# Altium schematic sheet ST_LINK_V2-1_2.SCHDOC: ST-LINK/V2-1
size A3; Author: P.A.; CompanyName: STMicroelectronics; Organization: Microcontrollers Division; Address1: 12, Rue Jules HOROWITZ; Address2: 38019 Grenoble; Address3: FRANCE; DocumentNumber: MB1261; Revision: B.01; SheetNumber: 5; SheetTotal: 15; Project: STM32L496G-DISCO
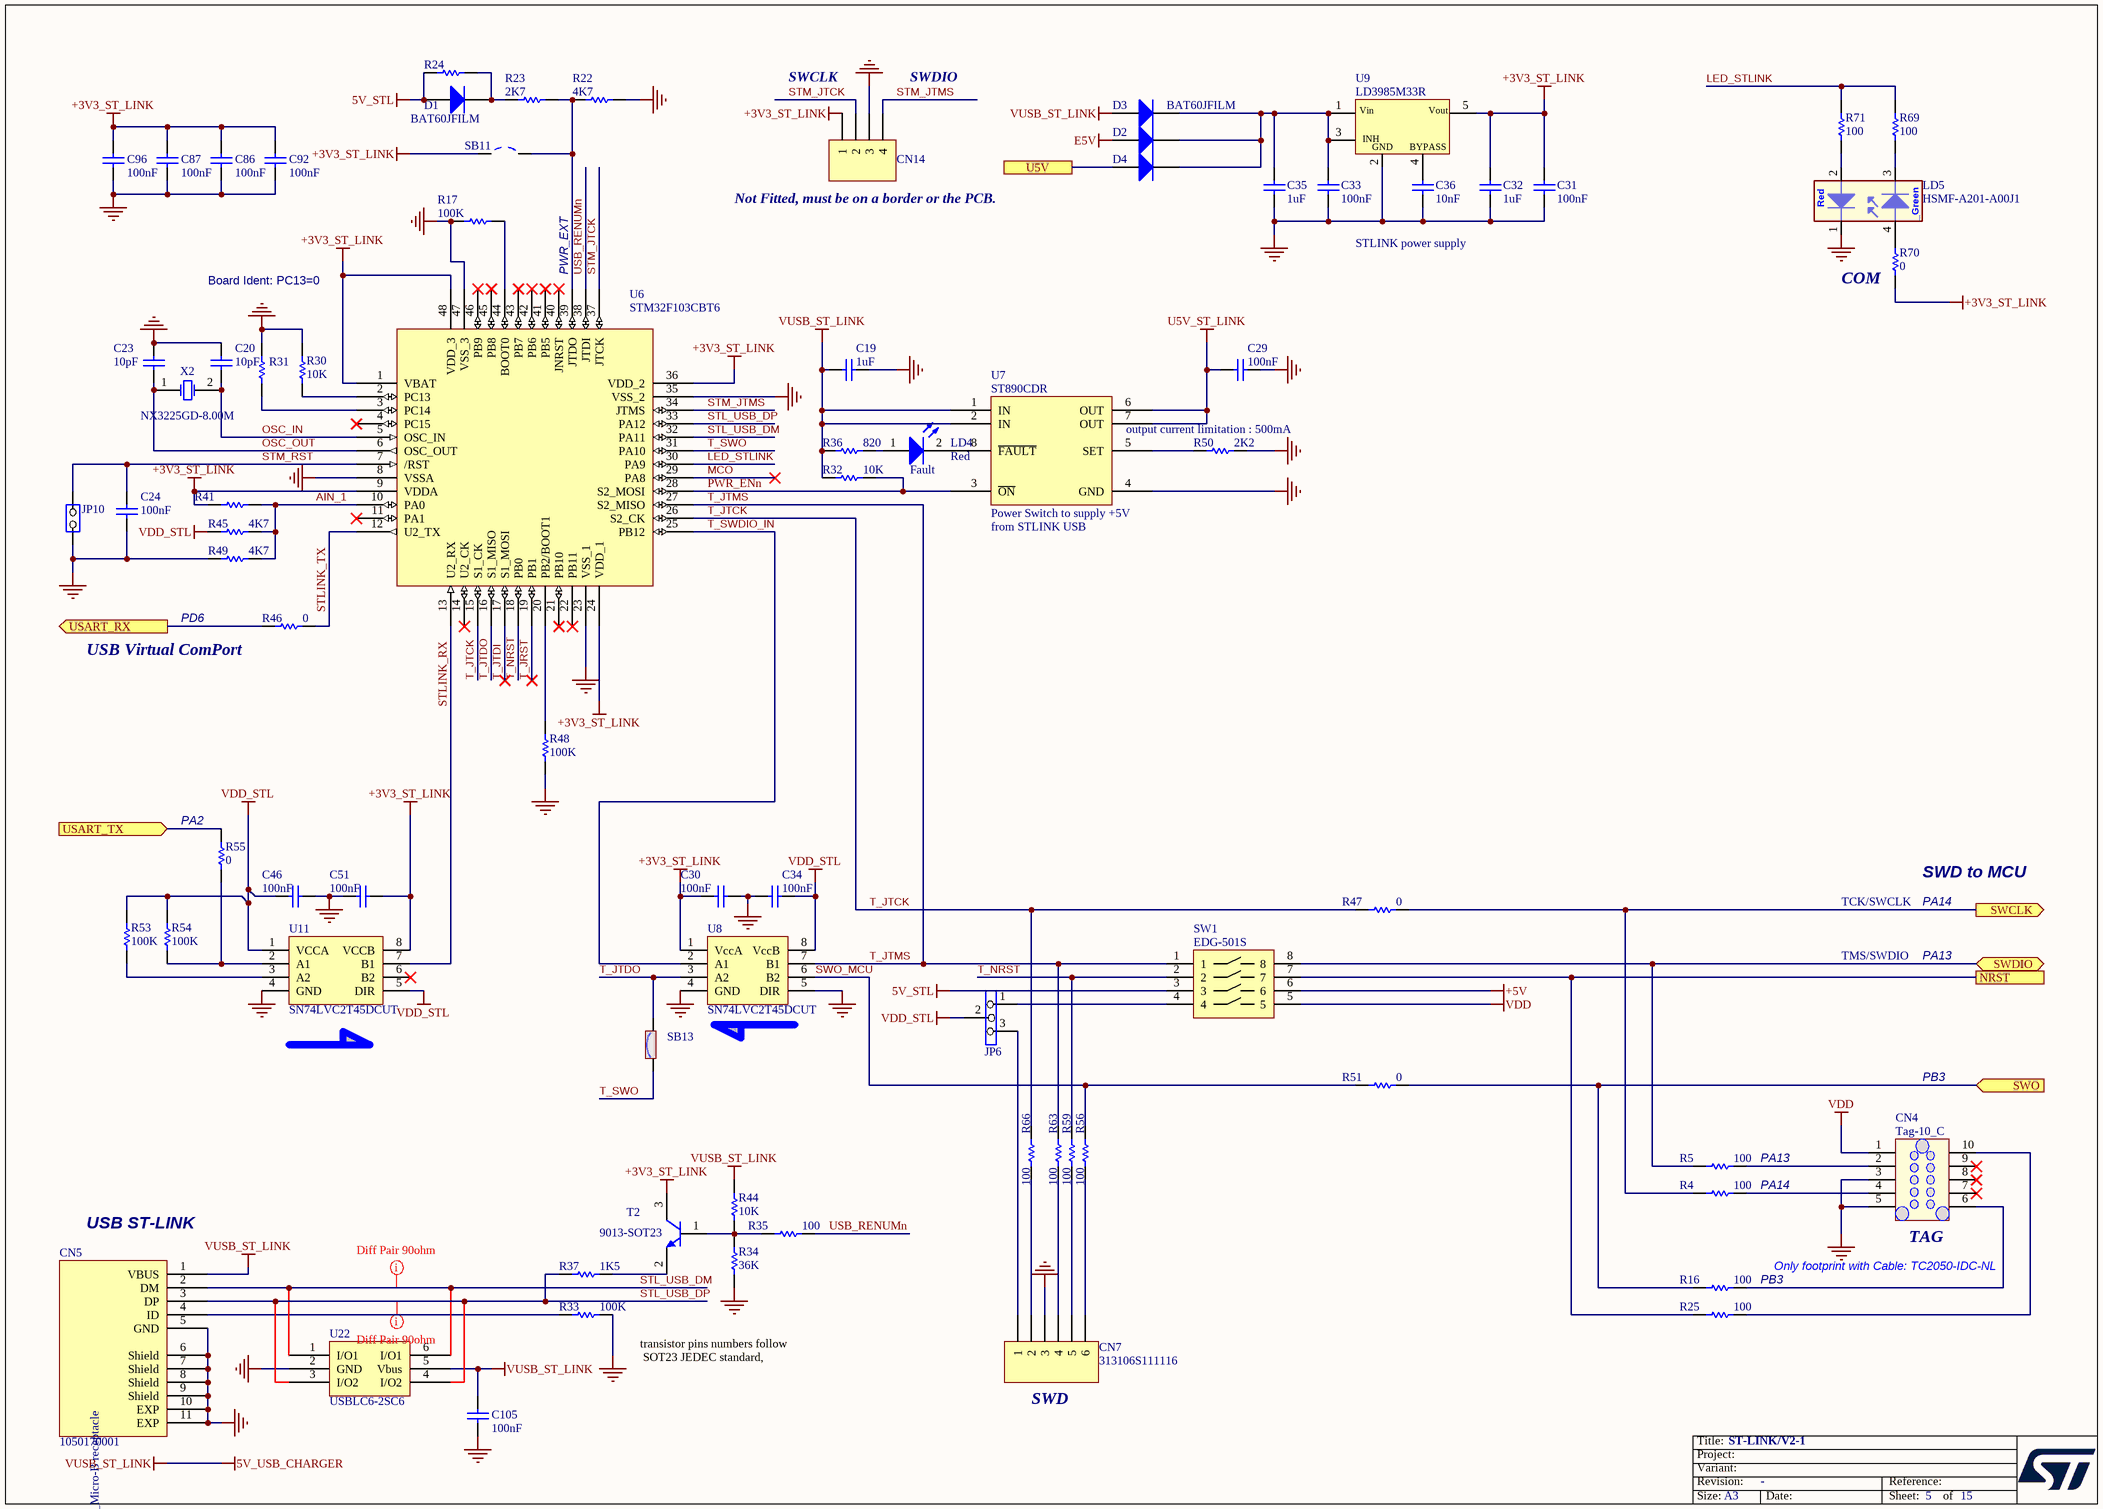
[diagram p0: ST_LINK_V2-1_2.SCHDOC]

## Parts
C19  value 1uF  [0603C]  (hidden comment: CC0603KRX5R7BB105)
C20  value 10pF  [0603C]  (hidden comment: CC0603JRNPO9BN100)
C23  value 10pF  [0603C]  (hidden comment: CC0603JRNPO9BN100)
C24  value 100nF  [0603C]  (hidden comment: CC0603KRX7R7BB104)
C29  value 100nF  [0603C]  (hidden comment: CC0603KRX7R7BB104)
C30  value 100nF  [0603C]  (hidden comment: CC0603KRX7R7BB104)
C31  value 100nF  [0603C]  (hidden comment: CC0603KRX7R7BB104)
C32  value 1uF  [0603C]  (hidden comment: CC0603KRX5R7BB105)
C33  value 100nF  [0603C]  (hidden comment: CC0603KRX7R7BB104)
C34  value 100nF  [0603C]  (hidden comment: CC0603KRX7R7BB104)
C35  value 1uF  [0603C]  (hidden comment: CC0603KRX5R7BB105)
C36  value 10nF  [0603C]  (hidden comment: CC0603KRX7R9BB103)
C46  value 100nF  [0603C]  (hidden comment: CC0603KRX7R7BB104)
C51  value 100nF  [0603C]  (hidden comment: CC0603KRX7R7BB104)
C86  value 100nF  [0603C]  (hidden comment: CC0603KRX7R7BB104)
C87  value 100nF  [0603C]  (hidden comment: CC0603KRX7R7BB104)
C92  value 100nF  [0603C]  (hidden comment: CC0603KRX7R7BB104)
C96  value 100nF  [0603C]  (hidden comment: CC0603KRX7R7BB104)
C105  value 100nF  [0603C]  (hidden comment: CC0603KRX7R7BB104)
CN4  Tag-10_C  [TC2050-IDC-NL]
CN5  1050170001  [MICRO_USB_B_105017]
CN7  313106S111116  [HDR_1X6_2R54_W]
CN14  (no value)  [HDR_1X4_2R54]
D1  BAT60JFILM  [SOD-323]
D2  (no value)  [SOD-323]
D3  BAT60JFILM  [SOD-323]
D4  (no value)  [SOD-323]
JP6  3 PIN Jumper  [SIP3]  (value not drawn)
JP10  (no value)  [SIP2]
LD4  Silkscreen: Fault  Corlor: Red  [0603D]  (hidden comment: 19-217/R6C-AL1M2VY/3T)
LD5  HSMF-A201-A00J1  [LED2_3528]
R4  value 100  [0603R]  (hidden comment: RC0603JR-07100RL)
R5  value 100  [0603R]  (hidden comment: RC0603JR-07100RL)
R16  value 100  [0603R]  (hidden comment: RC0603JR-07100RL)
R17  value 100K  [0603R]  (hidden comment: RC0603FR-07100KL)
R22  value 4K7  [0603R]  (hidden comment: RC0603FR-074K7L)
R23  value 2K7  [0603R]  (hidden comment: RC0603FR-072K7L)
R24  (no value)  [0603R]
R25  value 100  [0603R]  (hidden comment: RC0603JR-07100RL)
R30  value 10K  [0603R]  (hidden comment: RC0603FR-0710KL)
R31  (no value)  [0603R]
R32  value 10K  [0603R]  (hidden comment: RC0603FR-0710KL)
R33  value 100K  [0603R]  (hidden comment: RC0603FR-07100KL)
R34  value 36K  [0603R]  (hidden comment: RC0603FR-0736KL)
R35  value 100  [0603R]  (hidden comment: RC0603JR-07100RL)
R36  820  [0603R]
R37  value 1K5  [0603R]  (hidden comment: RC0603FR-071K5L)
R41  (no value)  [0603R]
R44  value 10K  [0603R]  (hidden comment: RC0603FR-0710KL)
R45  value 4K7  [0603R]  (hidden comment: RC0603FR-074K7L)
R46  value 0  [0603R]  (hidden comment: RC0603JR-070RL)
R47  value 0  [0603R]  (hidden comment: RC0603JR-070RL)
R48  value 100K  [0603R]  (hidden comment: RC0603FR-07100KL)
R49  value 4K7  [0603R]  (hidden comment: RC0603FR-074K7L)
R50  value 2K2  [0603R]  (hidden comment: RC0603FR-072K2L)
R51  value 0  [0603R]  (hidden comment: RC0603JR-070RL)
R53  value 100K  [0603R]  (hidden comment: RC0603FR-07100KL)
R54  value 100K  [0603R]  (hidden comment: RC0603FR-07100KL)
R55  value 0  [0603R]  (hidden comment: RC0603JR-070RL)
R56  value 100  [0603R]  (hidden comment: RC0603JR-07100RL)
R59  value 100  [0603R]  (hidden comment: RC0603JR-07100RL)
R63  value 100  [0603R]  (hidden comment: RC0603JR-07100RL)
R66  value 100  [0603R]  (hidden comment: RC0603JR-07100RL)
R69  value 100  [0603R]  (hidden comment: RC0603JR-07100RL)
R70  value 0  [0603R]  (hidden comment: RC0603JR-070RL)
R71  value 100  [0603R]  (hidden comment: RC0603JR-07100RL)
SB11  Solder Bridge OFF  [SB_0603]  (value not drawn)
SB13  Solder Bridge ON  [SB_0603]  (value not drawn)
SW1  EDG-501S  [SW1_11R7X9R7-12R2X9R65-HDR_CPT]
T2  9013-SOT23  [SOT-23]
U6  STM32F103CBT6  [LQFP48_0R5_9X9]
U7  ST890CDR  [SOIC8_1R27_4R9X6]
U8  SN74LVC2T45DCUT  [USOP8_0R5_2X3R1]
U9  LD3985M33R  [SOT23-5]
U11  SN74LVC2T45DCUT  [USOP8_0R5_2X3R1]
U22  USBLC6-2SC6  [SOT23-6L]
X2  NX3225GD-8.00M  [XTAL_2SM_3R2X2R5]

## Ports
NRST, SWCLK (out), SWDIO (bidir), SWO (in), U5V, USART_RX (out), USART_TX (in)

## Nets
5V_STL: D1.1(A) R24.2 SW1.3
5V_USB_CHARGER: C19.2 C105.1 CN5.1(VBUS) D3.1(A) R32.1 R36.2 R44.1 U7.1(IN) U7.2(IN) U22.5(Vbus)  [also labelled VUSB_ST_LINK]
+3V3_ST_LINK: C30.2 C31.1 C32.1 C51.2 C86.1 C87.1 C92.1 C96.1 CN14.1 R41.1 R70.1 SB11.1 T2.3(C) U6.1(VBAT) U6.9(VDDA) U6.24(VDD_1) U6.36(VDD_2) U6.48(VDD_3) U8.1(VccA) U9.5(Vout) U11.8(VCCB)
+5V: SW1.6
E5V: D2.1(A)
GND: C19.1 C20.1 C23.1 C24.2 C29.1 C30.1 C31.2 C32.2 C33.2 C34.2 C35.2 C36.2 C46.2 C51.1 C86.2 C87.2 C92.2 C96.2 C105.2 CN4.3 CN4.5 CN5.5(GND) CN5.6(Shield) CN5.7(Shield) CN5.8(Shield) CN5.9(Shield) CN5.10(EXP) CN5.11(EXP) CN7.3 CN14.3 JP10.2(NO) LD5.1 R17.2 R22.1 R30.1 R31.1 R33.1 R34.2 R48.1 R49.2 R50.1 U6.8(VSSA) U6.23(VSS_1) U6.35(VSS_2) U6.47(VSS_3) U7.4(GND) U8.4(GND) U8.5(DIR) U9.2(GND) U11.4(GND) U22.2(GND)
U5V_ST_LINK: C29.2 U7.6(OUT) U7.7(OUT)
VDD: CN4.1 SW1.5
VDD_STL: C34.1 C46.1 JP6.2 R45.2 R53.2 R54.2 U8.8(VccB) U11.1(VCCA) U11.5(DIR)
AIN_1: R41.2 R45.1 R49.1 U6.10(PA0)
LED_STLINK: R69.1 R71.1 U6.30(PA9)
MCO: U6.29(PA8)
NRST: R25.2 SW1.7 ; port NRST
OSC_IN: C20.2 U6.5(OSC_IN) X2.2(OSC2)
OSC_OUT: C23.2 U6.6(OSC_OUT) X2.1(OSC1)
PWR_ENn: R32.2 U6.28(S2_MOSI) U7.3(~{ON})
STL_USB_DM: CN5.2(DM) U6.32(PA11) U22.1(I/O1) U22.6(I/O1)
STL_USB_DP: CN5.3(DP) R37.2 U6.33(PA12) U22.3(I/O2) U22.4(I/O2)
STLINK_RX: U6.13(U2_RX) U11.7(B1)
STLINK_TX: R46.1 U6.12(U2_TX)
STM_JTCK: CN14.2 U6.37(JTCK)
STM_JTMS: CN14.4 U6.34(JTMS)
STM_RST: C24.1 JP10.1(COMMON) U6.7(/RST)
SWCLK: R4.2 R47.1 ; port SWCLK
SWDIO: R5.2 SW1.8 ; port SWDIO
SWO: R16.2 R51.1 ; port SWO
SWO_MCU: R51.2 R56.2 U8.6(B2)
T_JRST: U6.19(PB1)
T_JTCK: R47.2 R66.2 U6.15(S1_CK) U6.26(S2_CK)
T_JTDI: U6.17(S1_MOSI)
T_JTDO: SB13.2 U6.16(S1_MISO) U8.3(A2)
T_JTMS: R63.2 SW1.1 U6.27(S2_MISO) U8.7(B1)
T_NRST: R59.2 SW1.2 U6.18(PB0)
T_SWDIO_IN: U6.25(PB12) U8.2(A1)
T_SWO: SB13.1 U6.31(PA10)
U5V: D4.1(A) ; port U5V
USART_RX: R46.2 ; port USART_RX
USART_TX: R55.1 ; port USART_TX
USB_RENUMn: R35.2 U6.38(JTDI)
NetC33_1: C33.1 C35.1 D2.2(K) D3.2(K) D4.2(K) U9.1(Vin) U9.3(CE)
NetC36_1: C36.1 U9.4(BYPASS)
NetCN4_2: CN4.2 R5.1
NetCN4_4: CN4.4 R4.1
NetCN4_6: CN4.6 R16.1
NetCN4_10: CN4.10 R25.1
NetCN5_4: CN5.4(ID) R33.2
NetCN7_1: CN7.1 JP6.3
NetCN7_2: CN7.2 R66.1
NetCN7_4: CN7.4 R63.1
NetCN7_5: CN7.5 R59.1
NetCN7_6: CN7.6 R56.1
NetD1_2: D1.2(K) R23.2 R24.1
NetJP6_1: JP6.1 SW1.4
NetLD4_1: LD4.1(A) R36.1
NetLD4_2: LD4.2(K) U7.8(~{FAULT})
NetLD5_2: LD5.2 R71.2
NetLD5_3: LD5.3 R69.2
NetLD5_4: LD5.4 R70.2
NetR17_1: R17.1 U6.44(BOOT0)
NetR22_2: R22.2 R23.1 SB11.2 U6.39(JTDO)
NetR30_2: R30.2 U6.2(PC13)
NetR31_2: R31.2 U6.3(PC14)
NetR34_1: R34.1 R35.1 R44.2 T2.1(B)
NetR37_1: R37.1 T2.2(E)
NetR48_2: R48.2 U6.20(PB2/BOOT1)
NetR50_2: R50.2 U7.5(SET)
NetR53_1: R53.1 U11.3(A2)
NetR54_1: R54.1 R55.2 U11.2(A1)

Not connected (* = marked no-connect by the designer): CN4 7* 8* 9*; U6 4(PC15)* 11(PA1)* 14(U2_CK)* 21(PB10)* 22(PB11)* 40(JNRST)* 41(PB5)* 42(PB6)* 43(PB7)* 45(PB8)* 46(PB9)*; U11 6(B2)*

## Layout directives
mark named Diff Pair 90ohm: STL_USB_DM, STL_USB_DP

## Notes on the sheet
- SWCLK
- SWDIO
- (near CN14) Not Fitted, must be on a border or the PCB.
- Board Ident: PC13=0
- PWR_EXT
- STLINK power supply
- (near R70) COM
- output current limitation : 500mA
- (near U7) Power Switch to supply +5V from STLINK USB
- PD6
- (near R46) USB Virtual ComPort
- (near R55) PA2
- TCK/SWCLK
- SWD to MCU
- PA14
- TMS/SWDIO
- PA13
- PB3
- (near CN5) USB ST-LINK
- (near CN4) TAG
- Only footprint with Cable: TC2050-IDC-NL
- transistor pins numbers follow
  SOT23 JEDEC standard,
- (near CN7) SWD
- Title:
- Project:
- Size:
- Revision:
- Variant:
- A3
- -
- Date:
- Reference:
- Sheet:
- of
- (in symbol 1050170001) USB_Micro-B receptacle
- (in symbol LD3985M33R) INH
- (in symbol LD_BICOLOR_CMS) Red; _Green

## Library data of the parts
C19 C32 C35 = Cap: Capacitor,1uF,0603,16V,10%,X5R,YAGEO; Ordered by: Subcon; Published: 8-Jun-2000; Revision: July-2002: Re-released for DXP Platform.; Publisher: Altium Limited; Manuf_1: YAGEO; Manuf_Part_1: CC0603KRX5R7BB105
C20 C23 = Cap: Capacitor,10pF,5%,50V,NPO,0603,YAGEO; Ordered by: Subcon; Published: 8-Jun-2000; Revision: July-2002: Re-released for DXP Platform.; Publisher: Altium Limited; Manuf_1: YAGEO; Manuf_Part_1: CC0603JRNPO9BN100
C24 C29-C31 C33 C34 C46 C51 C86 C87 C92 C96 C105 = Cap: Capacitor,100nF,10%,16V,X7R,0603,YAGEO; Ordered by: Subcon; Published: 8-Jun-2000; Revision: July-2002: Re-released for DXP Platform.; Publisher: Altium Limited; Manuf_1: YAGEO; Manuf_Part_1: CC0603KRX7R7BB104
C36 = Cap: Capacitor,10nF,0603,50V,10%,X7R,YAGEO;; Ordered by: Subcon; Published: 8-Jun-2000; Revision: July-2002: Re-released for DXP Platform.; Publisher: Altium Limited; Manuf_1: YAGEO; Manuf_Part_1: CC0603KRX7R9BB103
CN4 = Tag-10_C: Footprint for TC2050-IDC-430 plug of nails (TM) cable for MP430; Manuf_1: None; Revision: 17-Jul-2002: Re-released for DXP Platform.; Manuf_Part_1: None
CN5 = 1050170001: Manuf_1: MOLEX; Silkscreen: USB; Ordered by: Subcon; ECCN_US/EU: NA; Manuf_Part_1: 1050170001
CN7 = Header 6: Header, 6-Pin; Manuf_1: lyconn; Ordered by: Subcon; Silkscreen: SWD; ECCN_US/EU: NA; LatestRevisionDate: 17-Jul-2002; LatestRevisionNote: Re-released for DXP Platform.; Publisher: Altium Limited; Manuf_Part_1: 313106S111116
CN14 = Header 4: Header, 4-Pin; ECCN_US/EU: [N/A]; Revision: 17-Jul-2002: Re-released for DXP Platform.; Publisher: Altium Limited; SOFER_FP: HDR_1X4_2R54
D1-D4 = BAT60JFILM: Provided: STM; ECCN_US/EU: EAR99/NEC; Ref St: 9151097; Revision: July-2002: Re-released for DXP Platform.; Order: BAT60JFILM; Manuf_Part_1: BAT60JFILM; Manuf_1: STM; Ordered by: STM
  D1-D3: Distrib: ST
  D4: Distrib: STM
JP6 = Jumper3: Manuf_1: lyconn; Manuf_Part_1: 313103S111116; Ordered by: Subcon
JP10 = JP2: Manuf_1: lyconn; Manuf_Part_1: 313102S111116; Ordered by: Subcon; Assembly: with jumper; ECCN_US/EU: NA
LD4 = LED2: LED, Red ,0603; Manuf_1: Everlight; Ordered by: Subcon; ECCN_US/EU: EAR99/NEC; Published: 8-Jun-2000; Revision: July-2002: Re-released for DXP Platform.; Publisher: Altium Limited; Manuf_Part_1: 19-217/R6C-AL1M2VY/3T
LD5 = LD_BICOLOR_CMS: Bicolor Led; Manuf_1: Avago Technologies; Manuf_2: everluck; Manuf_Part_2: LE-RGW35280; ECCN_US/EU: EAR99/NEC; Silkscreen: COM; Ordered by: Subcon; Distrib: RADIOSPARES; Manuf_Part_1: HSMF-A201-A00J1; Footprint: HSMF-A201
R4 R5 R16 R25 R35 R56 R59 R63 R66 R69 R71 = res1: Resistor, 100 ,0603,1%,YAGEO; Ordered by: Subcon; ECCN_US/EU: NA; Published: 8-Jun-2000; Revision: July-2002: Re-released for DXP Platform.; Publisher: Altium Limited; Manuf_1: YAGEO; Manuf_Part_1: RC0603JR-07100RL
R17 R33 R48 R53 R54 = res1: Resistor,100K,0603,1%,YAGEO; Ordered by: Subcon; ECCN_US/EU: NA; Published: 8-Jun-2000; Revision: July-2002: Re-released for DXP Platform.; Publisher: Altium Limited; Manuf_1: YAGEO; Manuf_Part_1: RC0603FR-07100KL
R22 R45 R49 = res1: Resistor,4.7K,0603,1%,YAGEO; Ordered by: Subcon; ECCN_US/EU: NA; Published: 8-Jun-2000; Revision: July-2002: Re-released for DXP Platform.; Publisher: Altium Limited; Manuf_1: YAGEO; Manuf_Part_1: RC0603FR-074K7L
R23 = res1: Resistor,2.7K,0603,1%,YAGEO; Ordered by: Subcon; ECCN_US/EU: NA; Published: 8-Jun-2000; Revision: July-2002: Re-released for DXP Platform.; Publisher: Altium Limited; Manuf_1: YAGEO; Manuf_Part_1: RC0603FR-072K7L
R24 = Res_0_5%_0402: Resistor,0,0603,5%,YAGEO; Manuf_Part_1: RC0603JR-070RL; Value: 0Ohm; ECCN_US/EU: [N/A]; Ordered by: Subcon; Manuf_1: YAGEO; Distrib: FARNELL
R30 R32 R44 = res1: Resistor,10K,0603,1%,YAGEO; Ordered by: Subcon; ECCN_US/EU: NA; Published: 8-Jun-2000; Revision: July-2002: Re-released for DXP Platform.; Publisher: Altium Limited; Manuf_1: YAGEO; Manuf_Part_1: RC0603FR-0710KL
R31 R41 = res1: Resistor,100K,0603,1%,YAGEO; Manuf_Part_1: RC0603FR-07100KL; Ordered by: Subcon; ECCN_US/EU: [N/A]; Published: 8-Jun-2000; Revision: July-2002: Re-released for DXP Platform.; Publisher: Altium Limited; Value: 100K; Manuf_1: YAGEO
R34 = res1: Resistor,36K,0603,1%,YAGEO; Ordered by: Subcon; ECCN_US/EU: NA; Published: 8-Jun-2000; Revision: July-2002: Re-released for DXP Platform.; Publisher: Altium Limited; Manuf_1: YAGEO; Manuf_Part_1: RC0603FR-0736KL
R36 = res1: Resistor; Manuf_1: YAGEO; Manuf_Part_1: RC0603FR-07820RL; Ordered by: Subcon; ECCN_US/EU: NA; Published: 8-Jun-2000; Revision: July-2002: Re-released for DXP Platform.; Publisher: Altium Limited; Value: 820
R37 = res1: Resistor,1.5K,0603,1%,YAGEO; Ordered by: Subcon; ECCN_US/EU: NA; Published: 8-Jun-2000; Revision: July-2002: Re-released for DXP Platform.; Publisher: Altium Limited; Manuf_1: YAGEO; Manuf_Part_1: RC0603FR-071K5L
R46 R47 R51 R55 R70 = res1: Resistor, 0 ,0603,1%,YAGEO; Ordered by: Subcon; ECCN_US/EU: NA; Published: 8-Jun-2000; Revision: July-2002: Re-released for DXP Platform.; Publisher: Altium Limited; Manuf_1: YAGEO; Manuf_Part_1: RC0603JR-070RL
R50 = res1: Resistor,2.2K,0603,1%,YAGEO; Ordered by: Subcon; ECCN_US/EU: NA; Published: 8-Jun-2000; Revision: July-2002: Re-released for DXP Platform.; Publisher: Altium Limited; Manuf_1: YAGEO; Manuf_Part_1: RC0603FR-072K2L
SB11 = SB_OFF: Solder: NO; Revision: July-2002: Re-released for DXP Platform.; ECCN_US/EU: N/A
SB13 = SB_ON: Manuf_1: YAGEO; Manuf_Part_1: RC0603JR-070RL; Solder: YES; Ordered By: Subcon; Revision: July-2002: Re-released for DXP Platform.; ECCN_US/EU: N/A
SW1 = EDG-501S: Gold Plated Contacts,4PST,1x4 Switch; Manuf_1: Grayhill Inc; Ordered by: Subcon; Second Source: NDS-04-V; Manuf_Part_1: EDG-501S
T2 = NPN: NPN Bipolar Transistor; Manuf_Part_1: MMBT9013; Code - JEDEC: TO-226-AA; Ordered by: Subcon; ECCN_US/EU: EAR99/NEC; Published: 8-Jun-2000; Revision: July-2002: Re-released for DXP Platform.; Publisher: Altium Limited
U6 = STM32F10x(48pin): IC,STM32F103CBT6,LQFP-48; Ordered by: STM; ECCN_US/EU: 3A991A2/NEC; Ref St: 9175111; Distrib: ST; Manuf_1: STM; Manuf_Part_1: STM32F103CBT6
U7 = ST890CDR: Manuf_1: ST; Ordered by: STM; Manuf_Part_1: ST890CDR
U8 U11 = SN74LVC2T45DCUT: Manuf_1: TI; Ordered by: Subcon; ECCN_US/EU: EAR99/NEC; Manuf_Part_1: SN74LVC2T45DCUT
U9 = LD3985M33R: Ultra low drop-low noise BiCMOS voltage, regulators low ESR capacitors compatible; Manuf_1: STM; Manuf_Part_2: LDK120DM33R; Ref St: 9176161; ECCN_US/EU: EAR99/NEC; Manuf_Part_1: LD3985M33R; Provided: STM; Distrib: STM; Order: LD3985M33R; Ordered by: STM; Manuf_2: STM
U22 = USBLC6-2SC6: Manuf_1: STM; Manuf_Part_1: USBLC6-2SC6; Ordered by: STM
X2 = XTAL_8M_NX3225GD: Crystal 8Mhz, 8pF, -+50PPM, SMD; Manuf_1: NDK; Manuf_Part_1: NX3225GD 8MHz EXS00A-CG04874; Manuf_Part_2: NX3225GD-8.000M-STD-CRA-3; ECCN_US/EU: EAR99/NEC; NDK Ref: X3127326; Ref St: 9157029; Provided: ST; Ordered by: STM; Order: NX3225GD 8MHz EXS00A-CG04874